# Altium schematic sheet BLDC_Gimbal_Top.SchDoc: BLDC_Gimbal_Top
size Legal; Date: 2019-06-12; CompanyName: UVic AERO; Engineer: Alexander Cote; DocumentNumber: 1; SheetNumber: 1; SheetTotal: 5
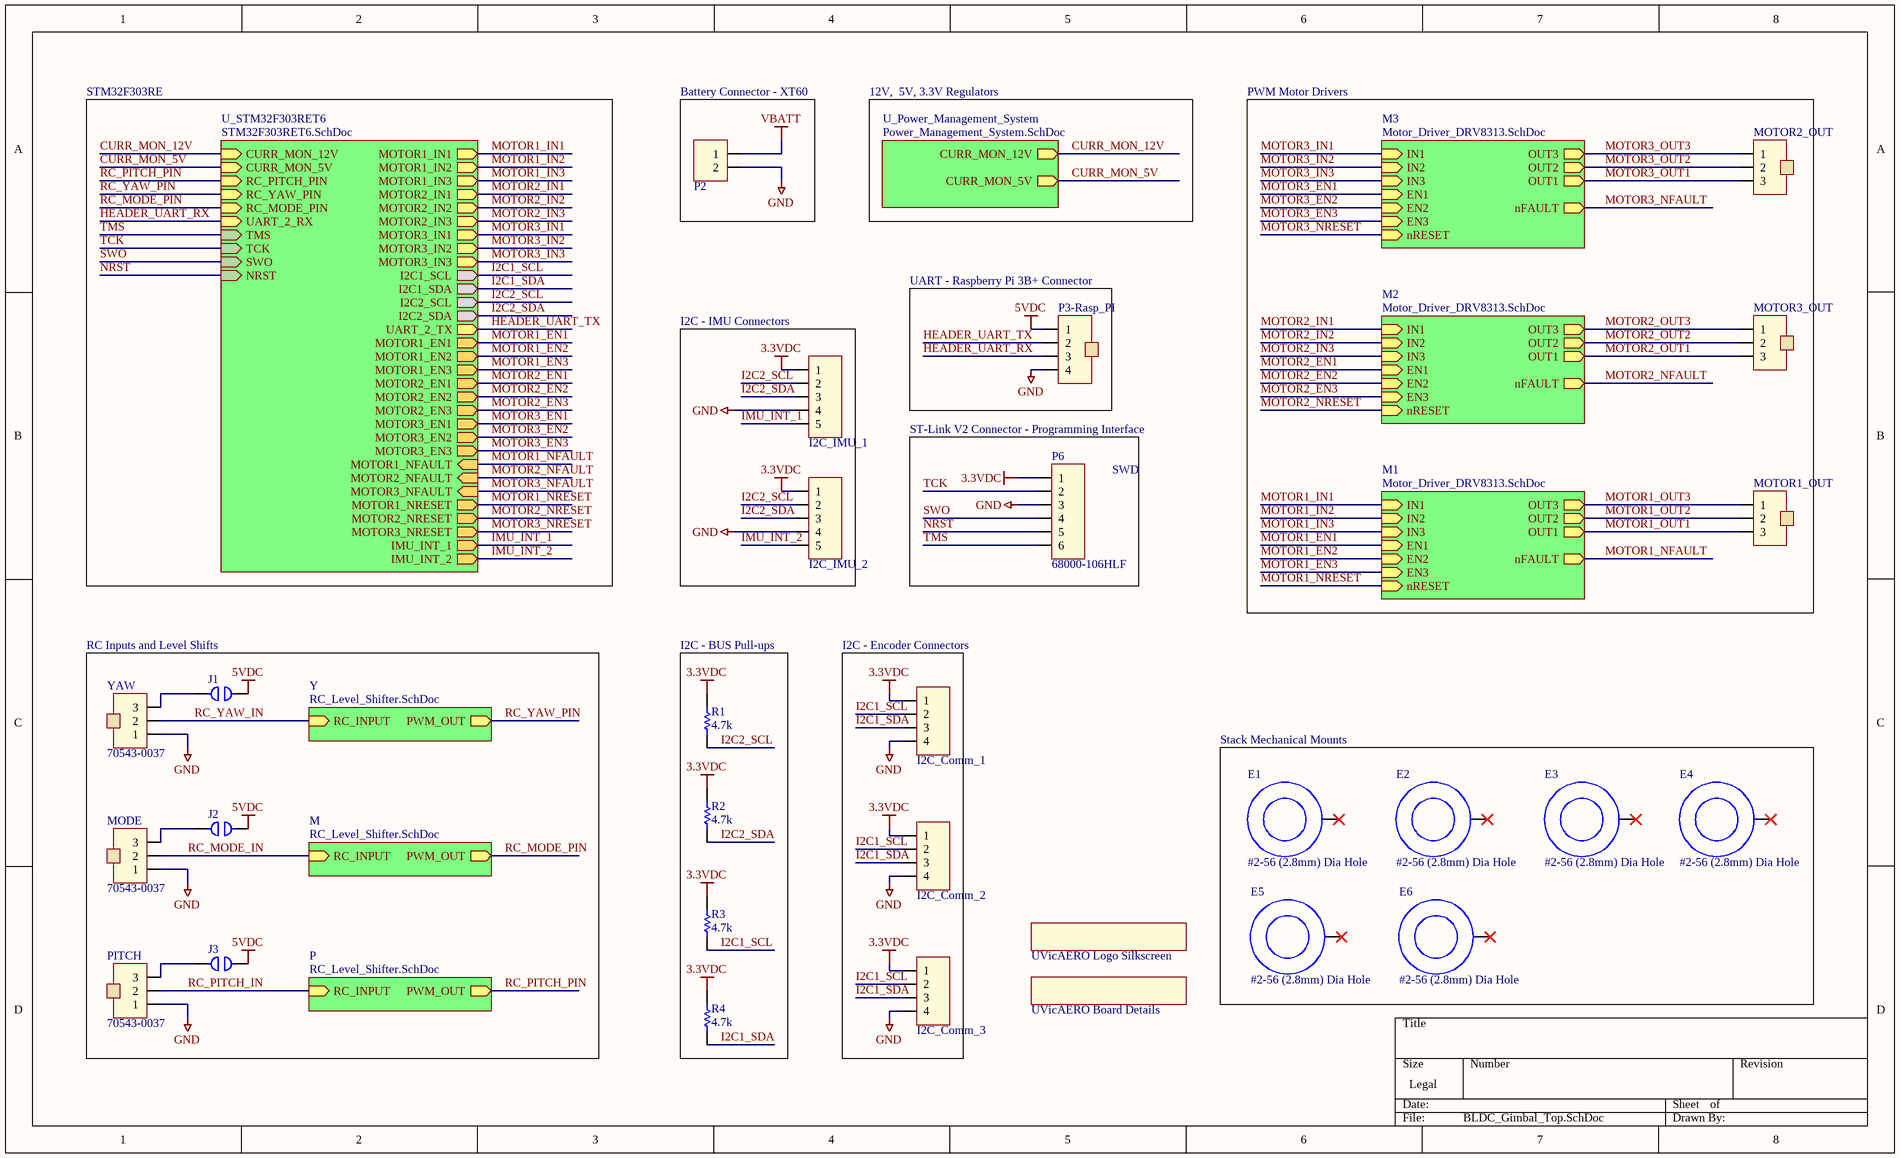
[diagram p0: BLDC_Gimbal_Top.SchDoc]

## Parts
E1  #2-56 (2.8mm) Dia Hole  [2-56, Mounting Hole]  (no BOM)
E2  #2-56 (2.8mm) Dia Hole  [2-56, Mounting Hole]  (no BOM)
E3  #2-56 (2.8mm) Dia Hole  [2-56, Mounting Hole]  (no BOM)
E4  #2-56 (2.8mm) Dia Hole  [2-56, Mounting Hole]  (no BOM)
E5  #2-56 (2.8mm) Dia Hole  [2-56, Mounting Hole]  (no BOM)
E6  #2-56 (2.8mm) Dia Hole  [2-56, Mounting Hole]  (no BOM)
I2C_Comm_1  B4B-ZR-SM4-TF(LF)(SN)  [1x4-PIN ZH 1.5mm Pitch]  (value not drawn)
I2C_Comm_2  B4B-ZR-SM4-TF(LF)(SN)  [1x4-PIN ZH 1.5mm Pitch]  (value not drawn)
I2C_Comm_3  B4B-ZR-SM4-TF(LF)(SN)  [1x4-PIN ZH 1.5mm Pitch]  (value not drawn)
I2C_IMU_1  B5B-ZR-SM4-TF(LF)(SN)  [1x5-PIN ZH 1.5mm Pitch]  (value not drawn)
I2C_IMU_2  B5B-ZR-SM4-TF(LF)(SN)  [1x5-PIN ZH 1.5mm Pitch]  (value not drawn)
J1  3M9580-ND  [Jumper-2Pin, THT]  (value not drawn)
J2  3M9580-ND  [Jumper-2Pin, THT]  (value not drawn)
J3  3M9580-ND  [Jumper-2Pin, THT]  (value not drawn)
LB1  UVicAERO Board Details  [UVicAERO, Board Details, Silkscreen]
LB2  UVicAERO Logo Silkscreen  [UVicAERO_Logo, 7mm Width]
MODE  70543-0037  [Header-3Pin, THT, Shrouded]
MOTOR1_OUT  70543-0037  [Header-3Pin, THT, Shrouded]  (value not drawn)
MOTOR2_OUT  70543-0037  [Header-3Pin, THT, Shrouded]  (value not drawn)
MOTOR3_OUT  70543-0037  [Header-3Pin, THT, Shrouded]  (value not drawn)
P2  2x1-Pin, Pitch: 3.00mm, Battery Connector  [XT60]  (value not drawn)
P3-Rasp_PI  43045-0412  [Header-4Pin, 2x2, THT, Locking, Tin]  (value not drawn)
P6  68000-106HLF  [Header-6Pin, THT]
PITCH  70543-0037  [Header-3Pin, THT, Shrouded]
R1  4.7k  [RESC2012N(0805")]
R2  4.7k  [RESC2012N(0805")]
R3  4.7k  [RESC2012N(0805")]
R4  4.7k  [RESC2012N(0805")]
YAW  70543-0037  [Header-3Pin, THT, Shrouded]

## Blocks framed on the sheet
Battery Connector - XT60: P2
PWM Motor Drivers: MOTOR1_OUT MOTOR2_OUT MOTOR3_OUT
UART - Raspberry Pi 3B+ Connector: P3-Rasp_PI
I2C - IMU Connectors: I2C_IMU_1 I2C_IMU_2
RC Inputs and Level Shifts: J1-J3 MODE PITCH YAW
I2C - BUS Pull-ups: R1-R4
I2C - Encoder Connectors: I2C_Comm_1-I2C_Comm_3
Stack Mechanical Mounts: E1-E6

## Sub-sheets
M = RC_Level_Shifter.SchDoc: RC_INPUT (in), PWM_OUT (out)
M1 = Motor_Driver_DRV8313.SchDoc: nFAULT (out), OUT1 (out), OUT2 (out), OUT3 (out), IN1 (in), IN2 (in), IN3 (in), EN1 (in), EN2 (in), EN3 (in), nRESET (in)
M2 = Motor_Driver_DRV8313.SchDoc: nFAULT (out), OUT1 (out), OUT2 (out), OUT3 (out), IN1 (in), IN2 (in), IN3 (in), EN1 (in), EN2 (in), EN3 (in), nRESET (in)
M3 = Motor_Driver_DRV8313.SchDoc: nFAULT (out), OUT1 (out), OUT2 (out), OUT3 (out), IN1 (in), IN2 (in), IN3 (in), EN1 (in), EN2 (in), EN3 (in), nRESET (in)
P = RC_Level_Shifter.SchDoc: RC_INPUT (in), PWM_OUT (out)
U_Power_Management_System = Power_Management_System.SchDoc: CURR_MON_12V (out), CURR_MON_5V (out)
U_STM32F303RET6 = STM32F303RET6.SchDoc: MOTOR1_IN1 (out), MOTOR1_IN2 (out), MOTOR1_IN3 (out), MOTOR2_IN1 (out), MOTOR2_IN2 (out), MOTOR2_IN3 (out), MOTOR3_IN1 (out), MOTOR3_IN2 (out), MOTOR3_IN3 (out), I2C1_SCL (out), I2C1_SDA (out), I2C2_SCL (out), I2C2_SDA (out), CURR_MON_12V (in), CURR_MON_5V (in), RC_PITCH_PIN (in), RC_YAW_PIN (in), RC_MODE_PIN (in), UART_2_TX (out), UART_2_RX (in), MOTOR1_EN1 (out), MOTOR1_EN2 (out), MOTOR1_EN3 (out), MOTOR2_EN1 (out), MOTOR2_EN2 (out), MOTOR2_EN3 (out), MOTOR3_EN1 (out), MOTOR3_EN2 (out), MOTOR3_EN3 (out), MOTOR1_NFAULT (in), MOTOR2_NFAULT (in), MOTOR3_NFAULT (in), MOTOR1_NRESET (out), MOTOR2_NRESET (out), MOTOR3_NRESET (out), IMU_INT_1 (out), IMU_INT_2 (out), TMS (in), TCK (in), SWO (in), NRST (in)
Y = RC_Level_Shifter.SchDoc: RC_INPUT (in), PWM_OUT (out)

## Nets
3.3VDC: I2C_Comm_1.1 I2C_Comm_2.1 I2C_Comm_3.1 I2C_IMU_1.1 I2C_IMU_2.1 P6.1 R1.2 R2.2 R3.2 R4.2
5VDC: J1.2 J2.2 J3.2 P3-Rasp_PI.1
GND: I2C_Comm_1.4 I2C_Comm_2.4 I2C_Comm_3.4 I2C_IMU_1.4 I2C_IMU_2.4 MODE.1 P2.2 P3-Rasp_PI.4 P6.3 PITCH.1 YAW.1
VBATT: P2.1
CURR_MON_5V: sheet U_Power_Management_System/CURR_MON_5V, sheet U_STM32F303RET6/CURR_MON_5V
CURR_MON_12V: sheet U_Power_Management_System/CURR_MON_12V, sheet U_STM32F303RET6/CURR_MON_12V
HEADER_UART_RX: P3-Rasp_PI.3 ; sheet U_STM32F303RET6/UART_2_RX
HEADER_UART_TX: P3-Rasp_PI.2 ; sheet U_STM32F303RET6/UART_2_TX
I2C1_SCL: I2C_Comm_1.2 I2C_Comm_2.2 I2C_Comm_3.2 R3.1 ; sheet U_STM32F303RET6/I2C1_SCL
I2C1_SDA: I2C_Comm_1.3 I2C_Comm_2.3 I2C_Comm_3.3 R4.1 ; sheet U_STM32F303RET6/I2C1_SDA
I2C2_SCL: I2C_IMU_1.2 I2C_IMU_2.2 R1.1 ; sheet U_STM32F303RET6/I2C2_SCL
I2C2_SDA: I2C_IMU_1.3 I2C_IMU_2.3 R2.1 ; sheet U_STM32F303RET6/I2C2_SDA
IMU_INT_1: I2C_IMU_1.5 ; sheet U_STM32F303RET6/IMU_INT_1
IMU_INT_2: I2C_IMU_2.5 ; sheet U_STM32F303RET6/IMU_INT_2
MOTOR1_EN1: sheet M1/EN1, sheet U_STM32F303RET6/MOTOR1_EN1
MOTOR1_EN2: sheet M1/EN2, sheet U_STM32F303RET6/MOTOR1_EN2
MOTOR1_EN3: sheet M1/EN3, sheet U_STM32F303RET6/MOTOR1_EN3
MOTOR1_IN1: sheet M1/IN1, sheet U_STM32F303RET6/MOTOR1_IN1
MOTOR1_IN2: sheet M1/IN2, sheet U_STM32F303RET6/MOTOR1_IN2
MOTOR1_IN3: sheet M1/IN3, sheet U_STM32F303RET6/MOTOR1_IN3
MOTOR1_NFAULT: sheet M1/nFAULT, sheet U_STM32F303RET6/MOTOR1_NFAULT
MOTOR1_NRESET: sheet M1/nRESET, sheet U_STM32F303RET6/MOTOR1_NRESET
MOTOR1_OUT1: MOTOR1_OUT.3 ; sheet M1/OUT1
MOTOR1_OUT2: MOTOR1_OUT.2 ; sheet M1/OUT2
MOTOR1_OUT3: MOTOR1_OUT.1 ; sheet M1/OUT3
MOTOR2_EN1: sheet M2/EN1, sheet U_STM32F303RET6/MOTOR2_EN1
MOTOR2_EN2: sheet M2/EN2, sheet U_STM32F303RET6/MOTOR2_EN2
MOTOR2_EN3: sheet M2/EN3, sheet U_STM32F303RET6/MOTOR2_EN3
MOTOR2_IN1: sheet M2/IN1, sheet U_STM32F303RET6/MOTOR2_IN1
MOTOR2_IN2: sheet M2/IN2, sheet U_STM32F303RET6/MOTOR2_IN2
MOTOR2_IN3: sheet M2/IN3, sheet U_STM32F303RET6/MOTOR2_IN3
MOTOR2_NFAULT: sheet M2/nFAULT, sheet U_STM32F303RET6/MOTOR2_NFAULT
MOTOR2_NRESET: sheet M2/nRESET, sheet U_STM32F303RET6/MOTOR2_NRESET
MOTOR2_OUT1: MOTOR3_OUT.3 ; sheet M2/OUT1
MOTOR2_OUT2: MOTOR3_OUT.2 ; sheet M2/OUT2
MOTOR2_OUT3: MOTOR3_OUT.1 ; sheet M2/OUT3
MOTOR3_EN1: sheet M3/EN1, sheet U_STM32F303RET6/MOTOR3_EN1
MOTOR3_EN2: sheet M3/EN2, sheet U_STM32F303RET6/MOTOR3_EN2
MOTOR3_EN3: sheet M3/EN3, sheet U_STM32F303RET6/MOTOR3_EN3
MOTOR3_IN1: sheet M3/IN1, sheet U_STM32F303RET6/MOTOR3_IN1
MOTOR3_IN2: sheet M3/IN2, sheet U_STM32F303RET6/MOTOR3_IN2
MOTOR3_IN3: sheet M3/IN3, sheet U_STM32F303RET6/MOTOR3_IN3
MOTOR3_NFAULT: sheet M3/nFAULT, sheet U_STM32F303RET6/MOTOR3_NFAULT
MOTOR3_NRESET: sheet M3/nRESET, sheet U_STM32F303RET6/MOTOR3_NRESET
MOTOR3_OUT1: MOTOR2_OUT.3 ; sheet M3/OUT1
MOTOR3_OUT2: MOTOR2_OUT.2 ; sheet M3/OUT2
MOTOR3_OUT3: MOTOR2_OUT.1 ; sheet M3/OUT3
NRST: P6.5 ; sheet U_STM32F303RET6/NRST
RC_MODE_IN: MODE.2 ; sheet M/RC_INPUT
RC_MODE_PIN: sheet M/PWM_OUT, sheet U_STM32F303RET6/RC_MODE_PIN
RC_PITCH_IN: PITCH.2 ; sheet P/RC_INPUT
RC_PITCH_PIN: sheet P/PWM_OUT, sheet U_STM32F303RET6/RC_PITCH_PIN
RC_YAW_IN: YAW.2 ; sheet Y/RC_INPUT
RC_YAW_PIN: sheet Y/PWM_OUT, sheet U_STM32F303RET6/RC_YAW_PIN
SWO: P6.4 ; sheet U_STM32F303RET6/SWO
TCK: P6.2 ; sheet U_STM32F303RET6/TCK
TMS: P6.6 ; sheet U_STM32F303RET6/TMS
NetJ1_1: J1.1 YAW.3
NetJ2_1: J2.1 MODE.3
NetJ3_1: J3.1 PITCH.3

Not connected (* = marked no-connect by the designer): E1 0*; E2 0*; E3 0*; E4 0*; E5 0*; E6 0*

## Notes on the sheet
- STM32F303RE
- 12V,  5V, 3.3V Regulators
- ST-Link V2 Connector - Programming Interface
- (near P6) SWD
- Title
- Size:
- Date:
- Legal
- Number:
- Time:
- Revision:
- Sheet
- of
- File:

## Library data of the parts
E1-E6 = #2-56, w-Pin, Mounting Hole: #2-56, with Pin, Mounting Hole; Publisher: UVic AERO, KCMR; Published: Feb 8, 2014
I2C_Comm_1-I2C_Comm_3 = B4B-ZR-SM4-TF(LF)(SN): Conn Shrouded Header HDR 4 POS 1.5mm Solder ST SMD T/R; Manufacturer: JST; Number of Positions: 4; Current Rating: 1A; Gender: Male; Connector Type: Male Pin; Contact Resistance: 30mR; Max Voltage Rating (AC): 50V; Supplier 1: Digi-Key; Manufacturer Part Number: B4B-ZR-SM4-TF(LF)(SN); Stock 1: 27718; Pricing 1: 1 = 0.71000, 10 = 0.67000, 100 = 0.51380, 500 = 0.44682 (USD); RoHS: Yes; Mount: Surface Mount; Contact Plating: Tin; Contact Material: Tin; Color: Natural; Housing Color: Beige; Housing Material: Polyamide; Min Operating Temperature: -25°C; Max Operating Temperature: 85°C; Number of Rows: 1; Packaging: Tape and Reel; Termination: Solder; Number of Contacts: 4; Max Current Rating: 1A; Fastening Type: Detent; Orientation: Straight; Length: 9mm; Height: 7.2mm; Pitch: 1.5mm; Width: 3.5mm; Depth: 3.7mm; Lead Free: Lead Free; ComponentLink1URL: https://datasheet.ciiva.com/26924/getdatasheetpartid-640935-26924037.pdf?src-supplier=Verical; ComponentLink1Description: https://datasheet.ciiva.com/26924/getdatasheetpartid-640935-26924037.pdf?src-supplier=Verical; Supplier Part Number 1: 455-1683-1-ND
I2C_IMU_1 I2C_IMU_2 = B5B-ZR-SM4-TF(LF)(SN): CONN HEADER ZH TOP 5POS 1.5MM; Manufacturer: JST; Number of Positions: 5; Gender: Male; Current Rating: 1A; Connector Type: Male Pin; Pitch: 0.059inch; Supplier 1: Digi-Key; Manufacturer Part Number: B5B-ZR-SM4-TF(LF)(SN); Stock 1: 52019; Pricing 1: 1 = 0.790000, 10 = 0.742000, 100 = 0.568600, 500 = 0.494420 (USD); RoHS: Yes; Mount: Surface Mount; Contact Material: Tin; Contact Plating: Tin; Housing Color: Natural; Housing Material: Nylon; Color: Natural; Number of Rows: 1; Packaging: Tape and Reel; Number of Contacts: 5; Termination: Solder; Fastening Type: Detent; Length: 10.5mm; Height: 7.2mm; Width: 3.5mm; Lead Free: Lead Free; ComponentLink1URL: http://www.jst-mfg.com/product/pdf/eng/eZH.pdf?src-supplier=Digi-Key; ComponentLink1Description: http://www.jst-mfg.com/product/pdf/eng/eZH.pdf?src-supplier=Digi-Key; ComponentLink2URL: http://www.jst-mfg.com/product/pdf/eng/eZR.pdf?src-supplier=Future+Electronics; ComponentLink2Description: http://www.jst-mfg.com/product/pdf/eng/eZR.pdf?src-supplier=Future+Electronics; Supplier Part Number 1: 455-1684-1-ND
J1-J3 = Jumper, 0.1" (2.54mm), Gold, THT, 68001-202HLF: Jumper, 0.1" (2.54mm), Gold, THT, 68001-202HLF & 3M9580-ND; Mfg: FCI; Publisher: UVic AERO, Kirk Richardson; Published: 2014-10-19; LatestRevisionNote: *; LatestRevisionDate: *; Mfg#: 68001-202HLF; Verified: No; ReviewedBy: *; ReviewedDate: *; LatestRevisionBy: *; Supplier 1: Digi-Key; Supplier 2: Digi-Key; Supplier Part Number 1: 3M9580-ND; Supplier Part Number 2: 609-3469-ND
LB1 = Logo, UVic AERO, Board Details: Logo, UVic AERO, Board Details, Silkscreen; Publisher: UVic AERO, KCMR; Published: Feb 14, 2014
LB2 = Logo, UVic AERO 2014, 7mm: Logo, UVic AERO 2014, 7mm Width, Silkscreen; Publisher: UVic AERO, KCMR; Published: Feb 14, 2014
MODE MOTOR1_OUT MOTOR2_OUT MOTOR3_OUT PITCH YAW = 1x3-Pin, Pitch: 0.1" (2.54mm), Tin, THT, Shrouded, Locking, 70543-0037: Mfg: Molex Inc; ReviewedBy: Matthew Fitz; ReviewedNote: There should be tin pins instead of gold; Publisher: UVic AERO, Kirk Richardson; Published: 2014-03-16; LatestRevisionNote: Changed # of pins from 4 to 3; LatestRevisionDate: 2014-03-18; Mfg#: 70543-0037; ReviewedDate: 2014-03-19; Verified: Yes; Supplier 1: Digi-Key; Supplier Part Number 1: WM4825-ND; LatestRevisionBy: *
P2 = 2x1-Pin, Pitch: 3.00mm, Battery Connector: XT60 - 2x1-Pin, Pitch: 3.00mm, Battery Connector; Publisher: UVic AERO, Luke Mills; Published: 2016-12-15; ReviewedBy: *; ReviewedDate: *; Verified: *
P3-Rasp_PI = 2x2-Pin, Pitch: 3.00mm, Tin, THT, 43045-0412: 2x2-Pin, Pitch: 3.00mm, Tin, THT, Shrouded, Locking, 43045-0412; Mfg: Molex; ReviewedBy: Kirk Richardson; Publisher: UVic AERO, Taylor Eby; Published: 2014-03-13; LatestRevisionNote: Fixed footprint so it's aligned to pin 1; LatestRevisionDate: 2014-03-23; ReviewedDate: 2014-03-23; Verified: Yes; Supplier 1: Digi-Key; Supplier Part Number 1: WM1790-ND; Mfg#: 43045-0412; LatestRevisionBy: Kirk Richardson; ReviewedNote: *
P6 = Header, 1x6-Pin, Pitch: 0.1" (2.54mm), Gold 30µin, THT, 68000-106HLF: Mfg: FCI; Publisher: UVic AERO, Kirk Richardson; Published: 2014-03-16; LatestRevisionNote: *; LatestRevisionDate: *; ReviewedBy: *; ReviewedDate: *; Verified: No; Mfg#: 68000-106HLF; LatestRevisionBy: *; Supplier 1: Digi-Key; Supplier Part Number 1: 609-3249-ND
R1-R4 = RC0805FR-074K7L: RES SMD 4.7k ohm, 150 V, 0805 [2012 Metric], 250 mW,  1%; Manufacturer: Yageo; Resistance: 4.7kR; Temperature Coefficient: 100ppm/°C; Voltage Rating (DC): 150V; Power Rating: 125mW; Supplier 1: Digi-Key; Manufacturer Part Number: RC0805FR-074K7L; Stock 1: 5392599; Pricing 1: 1 = 0.10000, 10 = 0.04200, 100 = 0.01700, 1000 = 0.00762, 2500 = 0.00662 (USD); RoHS: Yes; Case/Package: 0805; Number of Pins: 2; Case Code (Metric): 2012; Case Code (Imperial): 0805; Min Operating Temperature: -55°C; Max Operating Temperature: 155°C; Tolerance: 1%; Composition: Thick Film; Packaging: Tape and Reel; Package Quantity: 5000; Voltage Rating: 150V; Number of Terminations: 2; Termination: SMD/SMT; Military Standard: Not; Max Power Dissipation: 125mW; Features: Moisture Resistant; Length: 0.079inch; Height: 0.024inch; Width: 0.049inch; Depth: 1.25mm; REACH SVHC: No SVHC; Lead Free: Lead Free; ComponentLink1URL: https://datasheet.ciiva.com/11808/0900766b8106beab-11808155.pdf?src-supplier=RSComponents; ComponentLink1Description: https://datasheet.ciiva.com/11808/0900766b8106beab-11808155.pdf?src-supplier=RSComponents; ComponentLink2URL: https://datasheet.ciiva.com/7941/1686128-7941805.pdf?src-supplier=Element14; ComponentLink2Description: https://datasheet.ciiva.com/7941/1686128-7941805.pdf?src-supplier=Element14; ComponentLink3URL: https://datasheet.ciiva.com/7941/444164-7941806.pdf?src-supplier=Element14; ComponentLink3Description: https://datasheet.ciiva.com/7941/444164-7941806.pdf?src-supplier=Element14; ComponentLink4URL: https://datasheet.ciiva.com/6547/pyu-r-int-thick-7-6547263.pdf?src-supplier=Digi-Key; ComponentLink4Description: https://datasheet.ciiva.com/6547/pyu-r-int-thick-7-6547263.pdf?src-supplier=Digi-Key; ComponentLink5URL: https://datasheet.ciiva.com/7941/444164-7941804.pdf?src-supplier=Element14; ComponentLink5Description: https://datasheet.ciiva.com/7941/444164-7941804.pdf?src-supplier=Element14; ComponentLink6URL: https://datasheet.ciiva.com/46447/444164-46447583.pdf?src-supplier=Element14; ComponentLink6Description: https://datasheet.ciiva.com/46447/444164-46447583.pdf?src-supplier=Element14; Supplier Part Number 1: 311-4.70KCRCT-ND